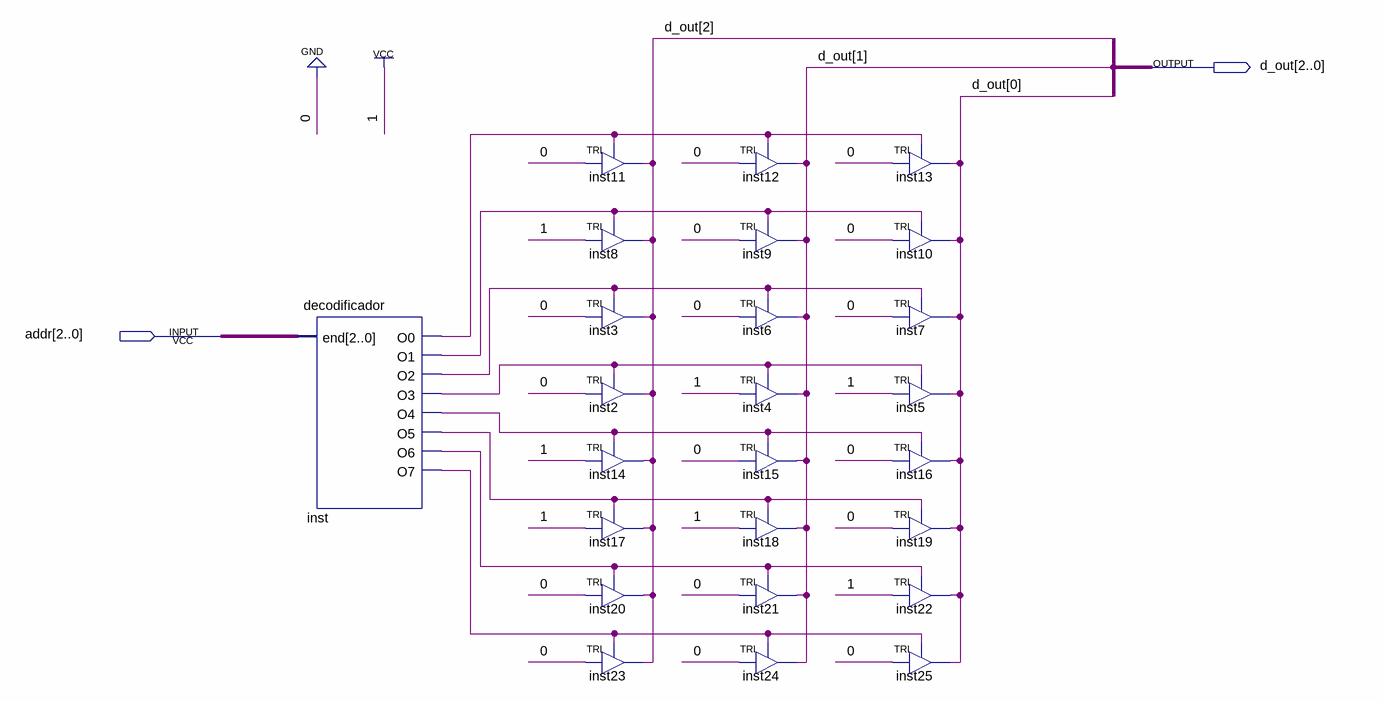
[diagram p0: schematic sheet]
// Quartus schematic progm4.bdf as structural Verilog: 25 symbols, 2 pins
module progm4 (
  input  [2:0] addr,
  output [2:0] d_out
);

  wire inst_o0, inst_o1, inst_o2, inst_o3, inst_o4, inst_o5, inst_o6, inst_o7;

  decodificador inst (
    .\end (addr), .O0(inst_o0), .O1(inst_o1), .O2(inst_o2), .O3(inst_o3), .O4(inst_o4), .O5(inst_o5),
    .O6(inst_o6), .O7(inst_o7));
  TRI inst11 (.IN(1'b0), .OE(inst_o0), .OUT(d_out[2]));
  TRI inst8 (.IN(1'b1), .OE(inst_o1), .OUT(d_out[2]));
  TRI inst3 (.IN(1'b0), .OE(inst_o2), .OUT(d_out[2]));
  TRI inst2 (.IN(1'b0), .OE(inst_o3), .OUT(d_out[2]));
  TRI inst14 (.IN(1'b1), .OE(inst_o4), .OUT(d_out[2]));
  TRI inst17 (.IN(1'b1), .OE(inst_o5), .OUT(d_out[2]));
  TRI inst20 (.IN(1'b0), .OE(inst_o6), .OUT(d_out[2]));
  TRI inst23 (.IN(1'b0), .OE(inst_o7), .OUT(d_out[2]));
  TRI inst12 (.IN(1'b0), .OE(inst_o0), .OUT(d_out[1]));
  TRI inst9 (.IN(1'b0), .OE(inst_o1), .OUT(d_out[1]));
  TRI inst6 (.IN(1'b0), .OE(inst_o2), .OUT(d_out[1]));
  TRI inst4 (.IN(1'b1), .OE(inst_o3), .OUT(d_out[1]));
  TRI inst15 (.IN(1'b0), .OE(inst_o4), .OUT(d_out[1]));
  TRI inst18 (.IN(1'b1), .OE(inst_o5), .OUT(d_out[1]));
  TRI inst21 (.IN(1'b0), .OE(inst_o6), .OUT(d_out[1]));
  TRI inst24 (.IN(1'b0), .OE(inst_o7), .OUT(d_out[1]));
  TRI inst13 (.IN(1'b0), .OE(inst_o0), .OUT(d_out[0]));
  TRI inst10 (.IN(1'b0), .OE(inst_o1), .OUT(d_out[0]));
  TRI inst7 (.IN(1'b0), .OE(inst_o2), .OUT(d_out[0]));
  TRI inst5 (.IN(1'b1), .OE(inst_o3), .OUT(d_out[0]));
  TRI inst16 (.IN(1'b0), .OE(inst_o4), .OUT(d_out[0]));
  TRI inst19 (.IN(1'b0), .OE(inst_o5), .OUT(d_out[0]));
  TRI inst22 (.IN(1'b1), .OE(inst_o6), .OUT(d_out[0]));
  TRI inst25 (.IN(1'b0), .OE(inst_o7), .OUT(d_out[0]));
endmodule
